# EAGLE design stb (EAGLE 8.6.0)
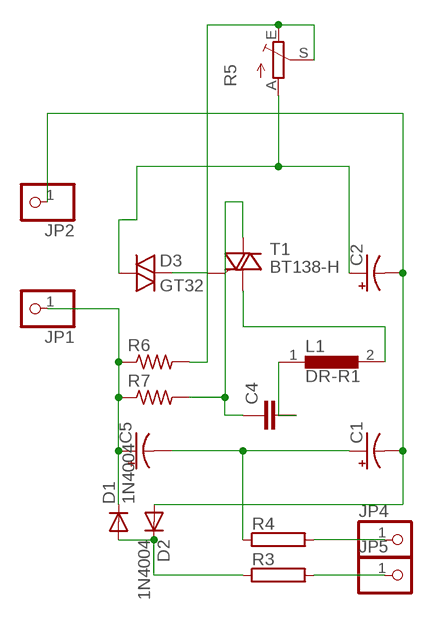
[diagram p0: schematic, sheet 1]

## Parts
C1  CPOL-USE7.5-16  [E7,5-16]
C2  CPOL-USE7.5-16  [E7,5-16]
C4  C10/5  [C10B5]
C5  CPOL-USE7.5-16  [E7,5-16]
D1  1N4004  [DO41-10]
D2  1N4004  [DO41-10]
D3  GT32  [GT32]
JP1  PINHD-1X1  [1X01]
JP2  PINHD-1X1  [1X01]
JP4  PINHD-1X1  [1X01]
JP5  PINHD-1X1  [1X01]
L1  DR-R1  [DR-R1]
R3  RKWP336  [KWP336]
R4  RKWP336  [KWP336]
R5  TRIM_EU-LI10  [LI10]
R6  R-US_0207/7  [0207/7]
R7  R-US_0207/7  [0207/7]
T1  BT138-H  [TO220BH]

## Nets
N$1: JP4.1 R4.2
N$2: C5.+ D1.C JP1.1 R6.1 R7.1
N$3: D1.A D2.C R3.1
N$4: JP5.1 R3.2
N$5: C1.+ C5.- R4.1
N$6: C1.- C2.- D2.A JP2.1
N$7: D3.2 T1.G
N$8: C4.1 R7.2 T1.T2(A2)
N$9: L1.2 T1.T1(A1)
N$10: C4.2 L1.1
N$12: C2.+ D3.1 R5.A
N$13: R5.E R5.S R6.2

## Library data of the parts
C1 C2 C5 = adafruit:CPOL-US: POLARIZED CAPACITOR, American symbol
C4 = capacitor-wima:C: CAPACITOR naming: grid - package width
D1 D2 = adafruit:1N4004: DIODE General purpose 1N400x type rectifier (With bigger pads) http://www.ladyada.net/library/pcb/eaglelibrary.html
D3 = triggered_devices:GT32: Trigger DIODE
JP1 JP2 JP4 JP5 = adafruit:PINHD-1X1: Pin header 1x1 for 0.1" spacing With round pins
L1 = inductors:DR-R1: INDUCTOR; SPICEPREFIX: L
R3 R4 = resistor-power:R: Power Resitor
R5 = pot:TRIM_EU-: POTENTIOMETER
R6 R7 = adafruit:R-US_: RESISTOR, American symbol
T1 = triac:BT138: TRIAC Source: http://www.semiconductors.philips.com BT138_SERIES_2.pdf

## Board
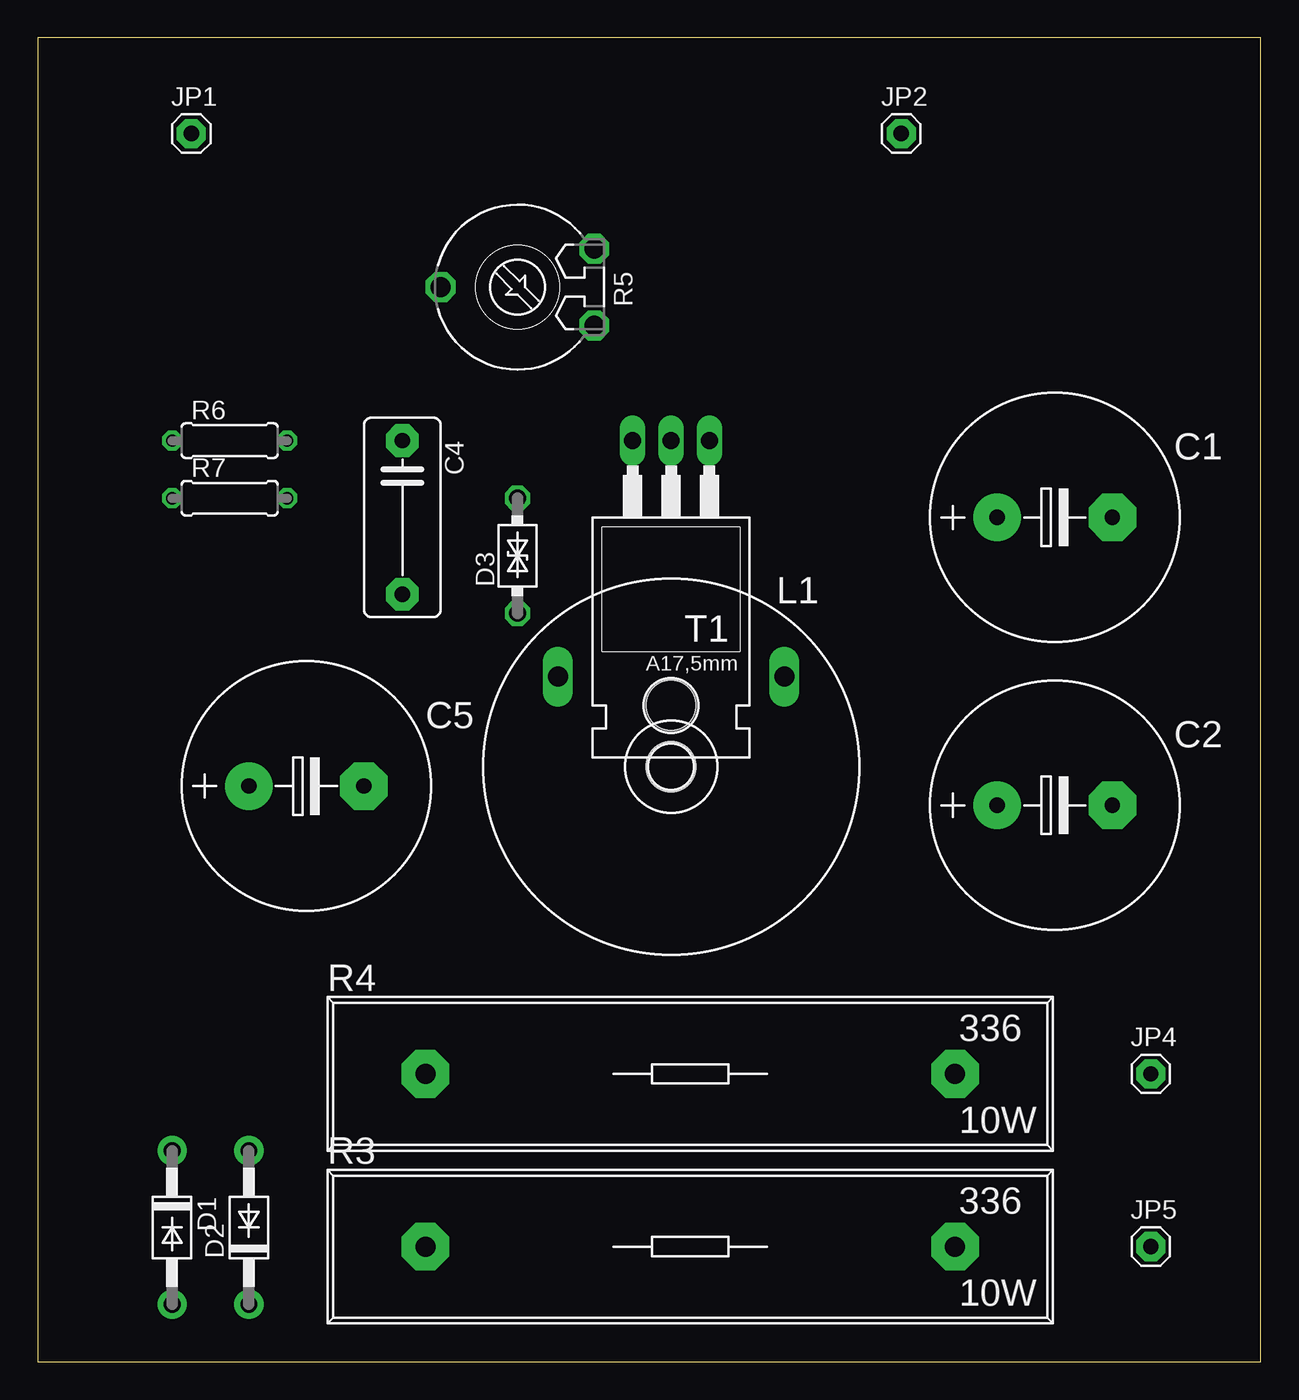
[diagram p1: board, top side]
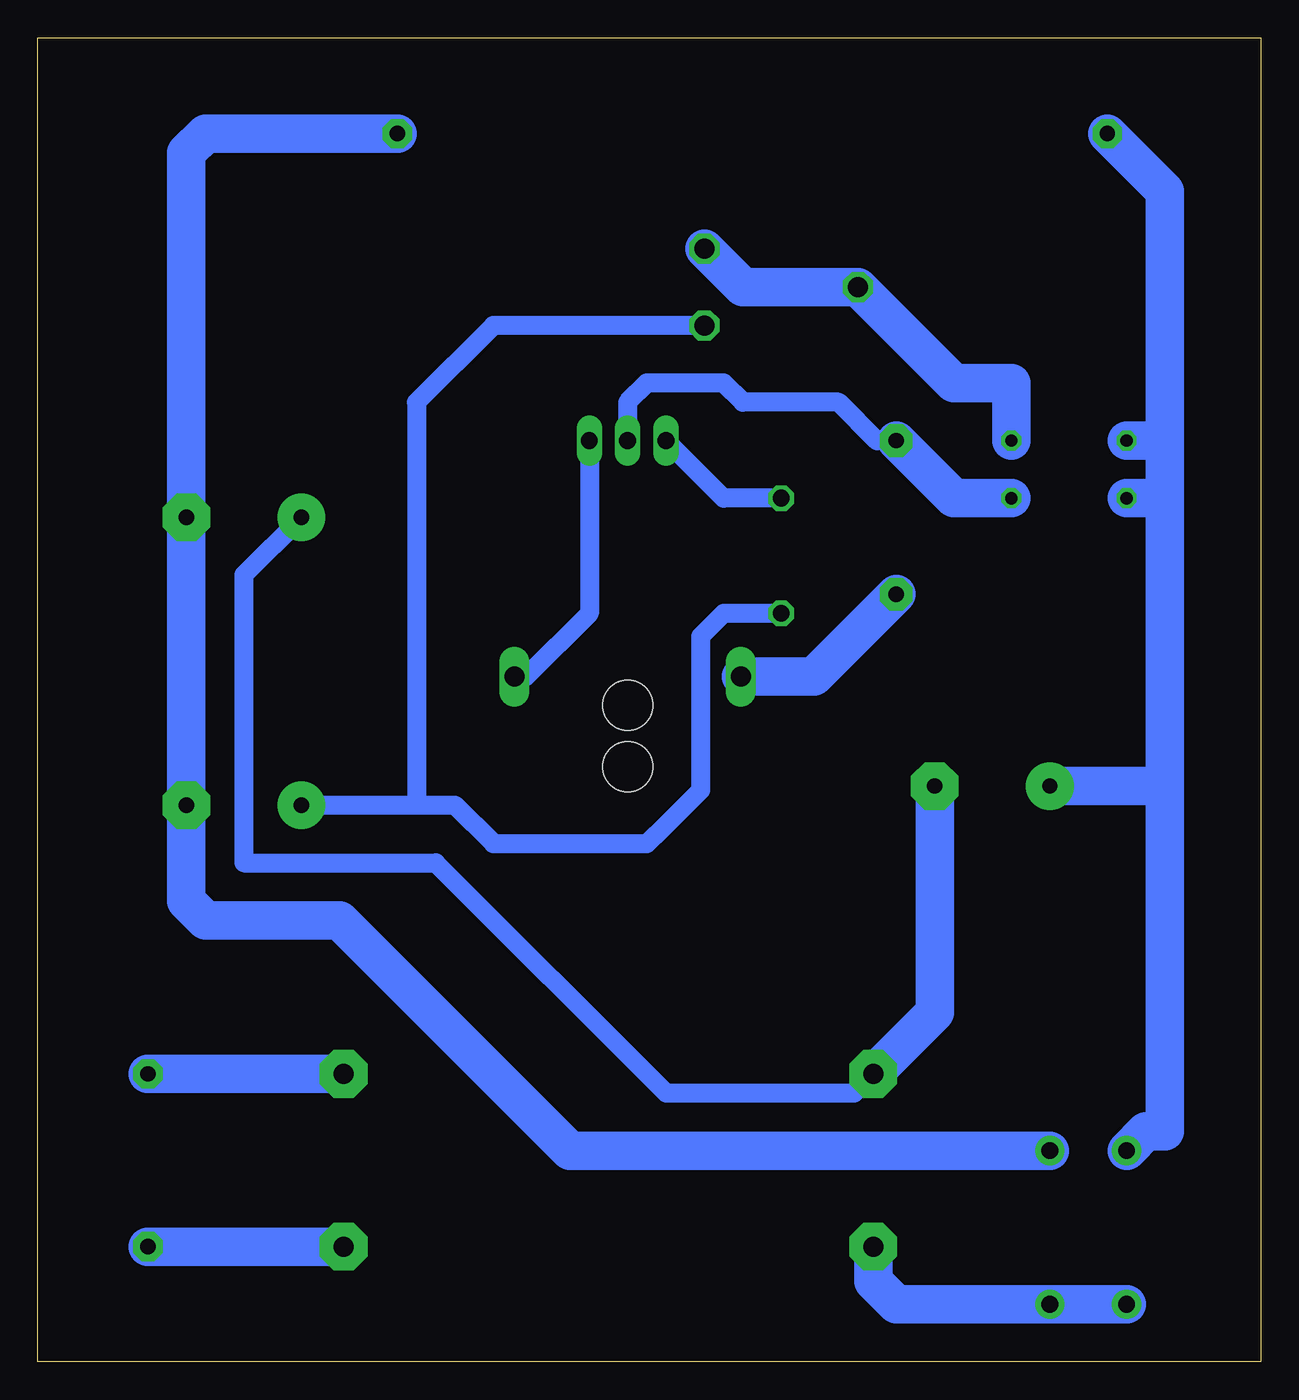
[diagram p2: board, bottom side, seen from below]

Size 80.95 x 87.62 mm. Coordinates in mm from the lower left corner, seen from the top.
Outline: 0,0 80.95,0 80.95,87.62 0,87.62 0,0
Copper layers (1*16): Top 0.035mm / dielectric 1.5mm / Bottom 0.035mm
Design rules "default": minimum track width 6mil, minimum drill 0.35mm, track to track 6mil, track to pad 6mil, pad to pad 6mil, via to via 6mil, smd to smd 6mil, copper to edge 40mil, drill to drill 6mil, minimum pad ring 10mil, minimum via ring 8mil, stop-mask expansion 4mil, vias tented up to drill 0mil, thermal gap 10mil

### Footprints (pad centres in the part's own frame; a part is rotated, then mirrored left to right if it is on the bottom)
E7,5-16 = drill 1.016 pad 3.15: + -3.81,0 | drill 1.016 pad 3.15 octagon: - 3.81,0
C10B5 = drill 1.016 pad 2.159 octagon: 1 -5.08,0; 2 5.08,0
DO41-10 = drill 1.118 pad 1.93: A 5.08,0; C -5.08,0
GT32 = drill 1.118 octagon: 1 -3.81,0; 2 3.81,0
1X01 = drill 1.016 pad 1.93 octagon: 1 0,0
DR-R1 = drill 1.321 long: 1 -7.493,5.969; 2 7.493,5.969 | hole 3.302: 0,0
KWP336 = drill 1.321 pad 3.15 octagon: 1 -17.526,0; 2 17.526,0
LI10 = drill 1.321 octagon: A -2.54,-5.08; E 2.54,-5.08; S 0,5.08
0207/7 = drill 0.813 octagon: 1 -3.81,0; 2 3.81,0
TO220BH = drill 1.118 long: G 2.54,-6.35; T1 -2.54,-6.35; T2 0,-6.35 | hole 3.302: 0,11.176

### Placement (x,y rotation side)
C1  67.31,55.88 0 top
C2  67.31,36.83 0 top
C4  24.13,55.88 270 top
C5  17.78,38.1 0 top
D1  8.89,8.89 270 top
D2  13.97,8.89 90 top
D3  31.75,53.34 90 top
JP1  10.16,81.28 0 top
JP2  57.15,81.28 0 top
JP4  73.66,19.05 0 top
JP5  73.66,7.62 0 top
L1  41.91,39.37 0 top
R3  43.18,7.62 0 top
R4  43.18,19.05 0 top
R5  31.75,71.12 90 top
R6  12.7,60.96 0 top
R7  12.7,57.15 0 top
T1  41.91,54.61 180 top

### Tracks (layer width: path | path; a pad name or v marks a point on that pad's centre or on a via)
N$1
  Bottom 2.54: R4.2 JP4.1
N$2
  Bottom 2.54: D1.C 7.62,15.24 6.35,15.24 6.35,38.1 | 6.35,38.1 6.35,57.15 | 6.35,57.15 6.35,60.96 | 6.35,60.96 6.35,77.47 JP1.1 | C5.+ 6.35,38.1 | R7.1 6.35,57.15 | R6.1 6.35,60.96
N$3
  Bottom 2.54: D1.A D2.C 24.13,3.81 25.65,5.33 R3.1
N$4
  Bottom 2.54: R3.2 JP5.1
N$5
  Bottom 1.27: C1.+ 67.31,52.07 67.31,33.02 54.61,33.02 39.37,17.78 26.92,17.78 R4.1
  Bottom 2.54: R4.1 21.59,23.11 C5.-
N$6
  Bottom 2.54: JP2.1 69.85,81.28 71.12,80.01 C1.- C2.- 71.12,30.48 69.85,29.21 60.96,29.21 45.72,13.97 D2.A
N$7
  Bottom 1.27: D3.2 35.56,57.15 T1.G
N$8
  Bottom 1.27: C4.1 25.4,60.96 27.94,63.5 34.29,63.5 35.56,64.77 40.64,64.77 41.91,63.5 T1.T2
  Bottom 2.54: R7.2 20.32,57.15 C4.1
N$9
  Bottom 1.27: T1.T1 44.45,49.53 48.64,45.34 L1.2
N$10
  Bottom 2.54: L1.1 29.59,45.34 C4.2
N$12
  Bottom 1.27: 55.88,36.83 53.34,36.83 50.8,34.29 40.64,34.29 40.07,34.86 40.04,34.86 37.08,37.82 37.08,48.01 35.56,49.53 D3.1 | 55.88,36.83 C2.+ | R5.A 50.8,68.58 55.88,63.5 55.88,36.83
N$13
  Bottom 2.54: R6.2 16.51,64.77 20.32,64.77 R5.S 34.29,71.12 R5.E